# EAGLE design ESP32V1 based led+button (EAGLE 9.6.2)
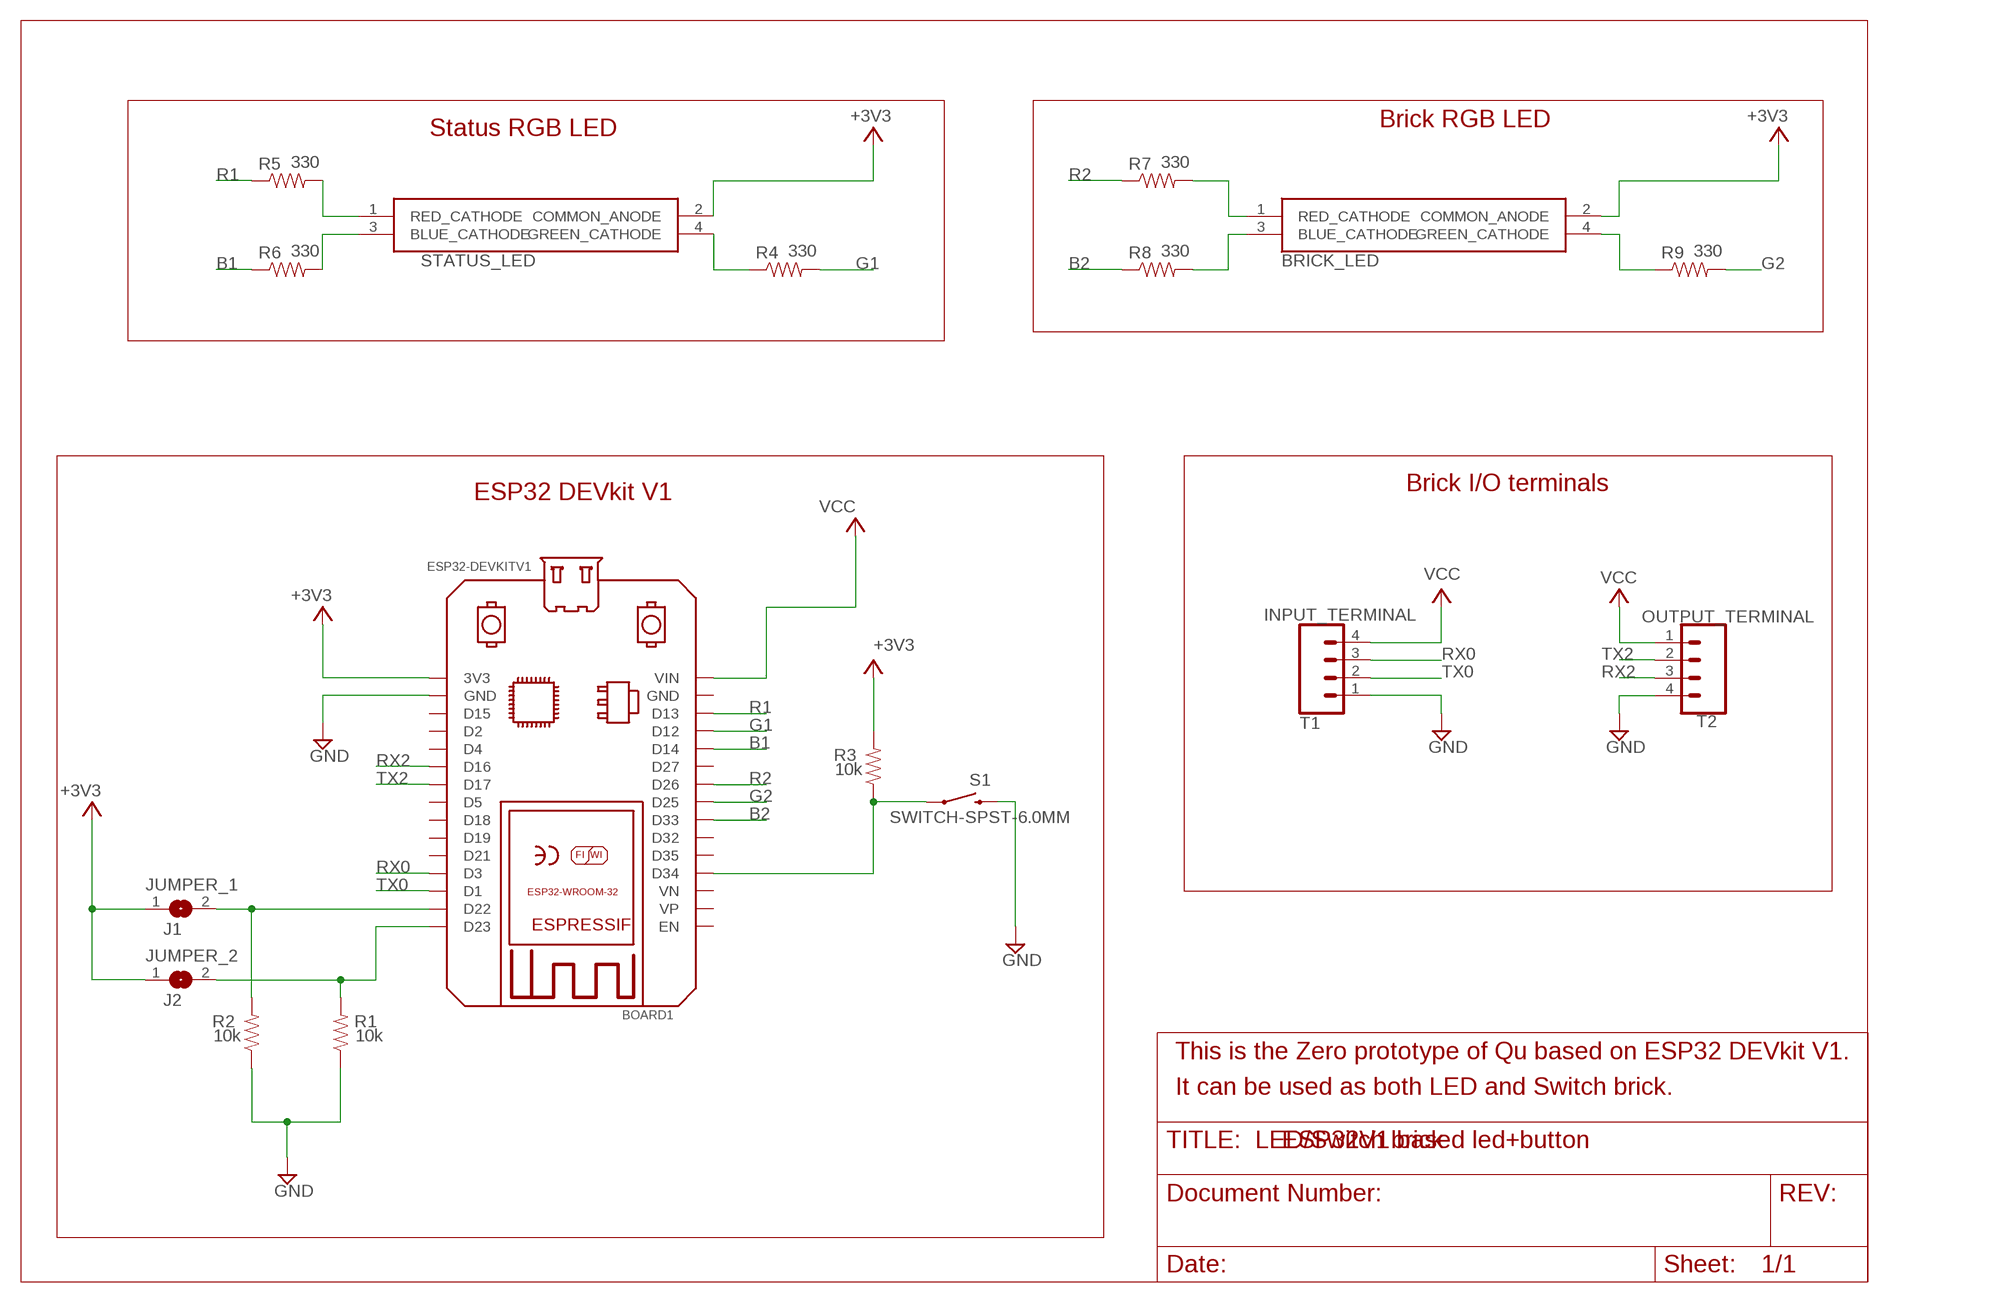
[diagram p0: schematic, sheet 1]

## Parts
BOARD1  ESP32DEVKITV1  [ESP32-DEVKITV1]
BRICK_LED  WP154A4SEJ3VBDZGW_CA  [L-154A4SUREQBFZGEC]
INPUT_TERMINAL  T1  CONN_04  [1X04]
JUMPER_1  J1  SJW  [SJW]
JUMPER_2  J2  SJW  [SJW]
OUTPUT_TERMINAL  T2  CONN_04  [1X04]
R1  10k  10KOHM-HORIZ-1/4W-1%  [AXIAL-0.3]
R2  10k  10KOHM-HORIZ-1/4W-1%  [AXIAL-0.3]
R3  10k  10KOHM-HORIZ-1/4W-1%  [AXIAL-0.3]
R4  330  330OHM-HORIZ-1/10W-5%  [AXIAL-0.3]
R5  330  330OHM-HORIZ-1/10W-5%  [AXIAL-0.3]
R6  330  330OHM-HORIZ-1/10W-5%  [AXIAL-0.3]
R7  330  330OHM-HORIZ-1/10W-5%  [AXIAL-0.3]
R8  330  330OHM-HORIZ-1/10W-5%  [AXIAL-0.3]
R9  330  330OHM-HORIZ-1/10W-5%  [AXIAL-0.3]
S1  SWITCH-SPST-6.0MM  MOMENTARY-SWITCH-SPST-PTH-6.0MM-KIT  [TACTILE_SWITCH_PTH_6.0MM_KIT]
STATUS_LED  WP154A4SEJ3VBDZGW_CA  [L-154A4SUREQBFZGEC]

## Nets
+3V3: BOARD1.3V3 BRICK_LED.2(COMMON_ANODE) JUMPER_1.1 JUMPER_2.1 R3.P$2 STATUS_LED.2(COMMON_ANODE)
B1: BOARD1.D14 R6.P$1
B2: BOARD1.D33 R8.P$1
G1: BOARD1.D12 R4.P$2
G2: BOARD1.D25 R9.P$2
GND: BOARD1.GND@1(GND) INPUT_TERMINAL.1 OUTPUT_TERMINAL.4 R1.P$1 R2.P$1 S1.3
N$1: BOARD1.D22 JUMPER_1.2 R2.P$2
N$3: BOARD1.D23 JUMPER_2.2 R1.P$2
N$6: R6.P$2 STATUS_LED.3(BLUE_CATHODE)
N$7: R5.P$2 STATUS_LED.1(RED_CATHODE)
N$9: BOARD1.D34 R3.P$1 S1.1
N$11: R4.P$1 STATUS_LED.4(GREEN_CATHODE)
N$14: BRICK_LED.3(BLUE_CATHODE) R8.P$2
N$15: BRICK_LED.1(RED_CATHODE) R7.P$2
N$16: BRICK_LED.4(GREEN_CATHODE) R9.P$1
R1: BOARD1.D13 R5.P$1
R2: BOARD1.D26 R7.P$1
RX0: BOARD1.D3 INPUT_TERMINAL.3
RX2: BOARD1.D16 OUTPUT_TERMINAL.3
TX0: BOARD1.D1 INPUT_TERMINAL.2
TX2: BOARD1.D17 OUTPUT_TERMINAL.2
VCC: BOARD1.VIN INPUT_TERMINAL.4 OUTPUT_TERMINAL.1
Unconnected: BOARD1.D2 BOARD1.D4 BOARD1.D5 BOARD1.D15 BOARD1.D18 BOARD1.D19 BOARD1.D21 BOARD1.D27 BOARD1.D32 BOARD1.D35 BOARD1.EN BOARD1.GND BOARD1.VN BOARD1.VP

## Notes on the sheet
- Brick RGB LED
- Status RGB LED
- Brick I/O terminals
- ESP32 DEVkit V1
- This is the Zero prototype of Qu based on ESP32 DEVkit V1.
- It can be used as both LED and Switch brick.
- LED/Switch brick

## Library data of the parts
BOARD1 = ESP32-DEVKITV1:ESP32DEVKITV1: https://github.com/shridattdudhat
BRICK_LED STATUS_LED = LED RGB:WP154A4SEJ3VBDZGW_CA: Standard LEDs - Through Hole 5MM RGB LED Source: Datasheet <http://www.kingbrightusa.com/images/catalog/SPEC/WP154A4SEJ3VBDZGW-CA.pdf>; DESCRIPTION: Standard LEDs - Through Hole 5MM RGB LED; HEIGHT: mm; MANUFACTURER_NAME: Kingbright; MANUFACTURER_PART_NUMBER: WP154A4SEJ3VBDZGW/CA; MOUSER_PART_NUMBER: 604-WP154A43VBDZGWCA; MOUSER_PRICE-STOCK: https://www.mouser.co.uk/ProductDetail/Kingbright/WP154A4SEJ3VBDZGW-CA?qs=YCa%2FAAYMW01xRqZww6UuiQ%3D%3D
INPUT_TERMINAL OUTPUT_TERMINAL = SparkFun-Connectors:CONN_04: Multi connection point. Often used as Generic Header-pin footprint for 0.1 inch spaced/style header connections On any of the 0.1 inch spaced packages, you can populate with these: Break Away Headers - Straight <https://www.sparkfun.com/products/116> (PRT-00116) Break Away Male Headers - Right Angle <https://www.sparkfun.com/products/553> (PRT-00553) Female Headers <https://www.sparkfun.com/products/115> (PRT-00115) Break Away Headers - Machine Pin <https://www.sparkfun.com/products/117> (PRT-00117) Break Away Female Headers - Swiss Machine Pin <https://www.sparkfun.com/products/743> (PRT-00743) For SCREWTERMINALS and SPRING TERMINALS visit here: Screw Terimnals on SparkFun.com <https://www.sparkfun.com/search/results?term=Screw+Terminals> (5mm/3.5mm/2.54mm spacing) This device is also useful as a general connection point to wire up your design to another part of your project. Our various solder wires solder well into these plated through hole pads. Hook-Up Wire - Assortment (Stranded, 22 AWG) <https://www.sparkfun.com/products/11375> (PRT-11375) Hook-Up Wire - Assortment (Solid Core, 22 AWG) <https://www.sparkfun.com/products/11367> (PRT-11367) View the entire wire category on our website here <https://www.sparkfun.com/categories/141> Special notes: Molex polarized connector foot print use with SKU : PRT-08231 with associated crimp pins and housings. 1MM SMD Version SKU: PRT-10208; PROD_ID: CONN-09696
JUMPER_1 JUMPER_2 = jumper:SJ: SMD solder JUMPER
R1-R3 = SparkFun-Resistors:10KOHM: 10kΩ resistor A resistor is a passive two-terminal electrical component that implements electrical resistance as a circuit element. Resistors act to reduce current flow, and, at the same time, act to lower voltage levels within circuits. - Wikipedia; PROD_ID: RES-12183
R4-R9 = SparkFun-Resistors:330OHM: 330Ω resistor A resistor is a passive two-terminal electrical component that implements electrical resistance as a circuit element. Resistors act to reduce current flow, and, at the same time, act to lower voltage levels within circuits. - Wikipedia; PROD_ID: RES-8371
S1 = SparkFun-Switches:MOMENTARY-SWITCH-SPST: Momentary Switch (Pushbutton) - SPST Normally-open (NO) SPST momentary switches (buttons, pushbuttons). Variants PTH-12MM - 12mm square, through-hole Momentary Pushbutton Switch - 12mm Square <https://www.sparkfun.com/products/9190> (COM-09190) PTH-6.0MM, PTH-6.0MM-KIT - 6.0mm square, through-hole Mini Pushbutton Switch <https://www.sparkfun.com/products/97> (COM-00097) KIT package intended for soldering kit's - only one side of pads' copper is exposed. PTH-RIGHT-ANGLE-KIT - Right-angle, through-hole Right Angle Tactile Button <https://www.sparkfun.com/products/10791> - Used on SparkFun BigTime Watch Kit <https://www.sparkfun.com/products/11734> SMD-12MM - 12mm square, surface-mount Tactile Button - SMD (12mm) <https://www.sparkfun.com/products/12993> (COM-12993) Used on SparkFun PicoBoard <https://www.sparkfun.com/products/11888> SMD-4.5MM - 4.5mm Square Trackball Switch Used on SparkFun Blackberry Trackballer Breakout <https://www.sparkfun.com/products/13169> SMD-4.6MMX2.8MM - 4.60mm x 2.80mm, surface mount Used on SparkFun SAMD21 Mini Breakout <https://www.sparkfun.com/products/13664> SMD-5.2MM, SMD-5.2-REDUNDANT - 5.2mm square, surface-mount Mini Pushbutton Switch - SMD <https://www.sparkfun.com/products/8720> (COM-08720) Used on Arduino Pro Mini <https://www.sparkfun.com/products/11114> REDUNDANT package connects both switch circuits together SMD-6.0X3.5MM - 6.0 x 3.5mm, surface mount Momentary Reset Switch SMD <https://www.sparkfun.com/products/8229> (COM-08229) SMD-6.2MM-TALL - 6.2mm square, surface mount Tactile Button - SMD (6mm) <https://www.sparkfun.com/products/12992> Used on SparkFun Digital Sandbox <https://www.sparkfun.com/products/12651> SMD-RIGHT-ANGLE - Right-angle, surface mount Used on SparkFun Block for Intel® Edison - Arduino <https://www.sparkfun.com/products/13036>; PROD_ID: SWCH-08441; SF_SKU: COM-00097

## Board
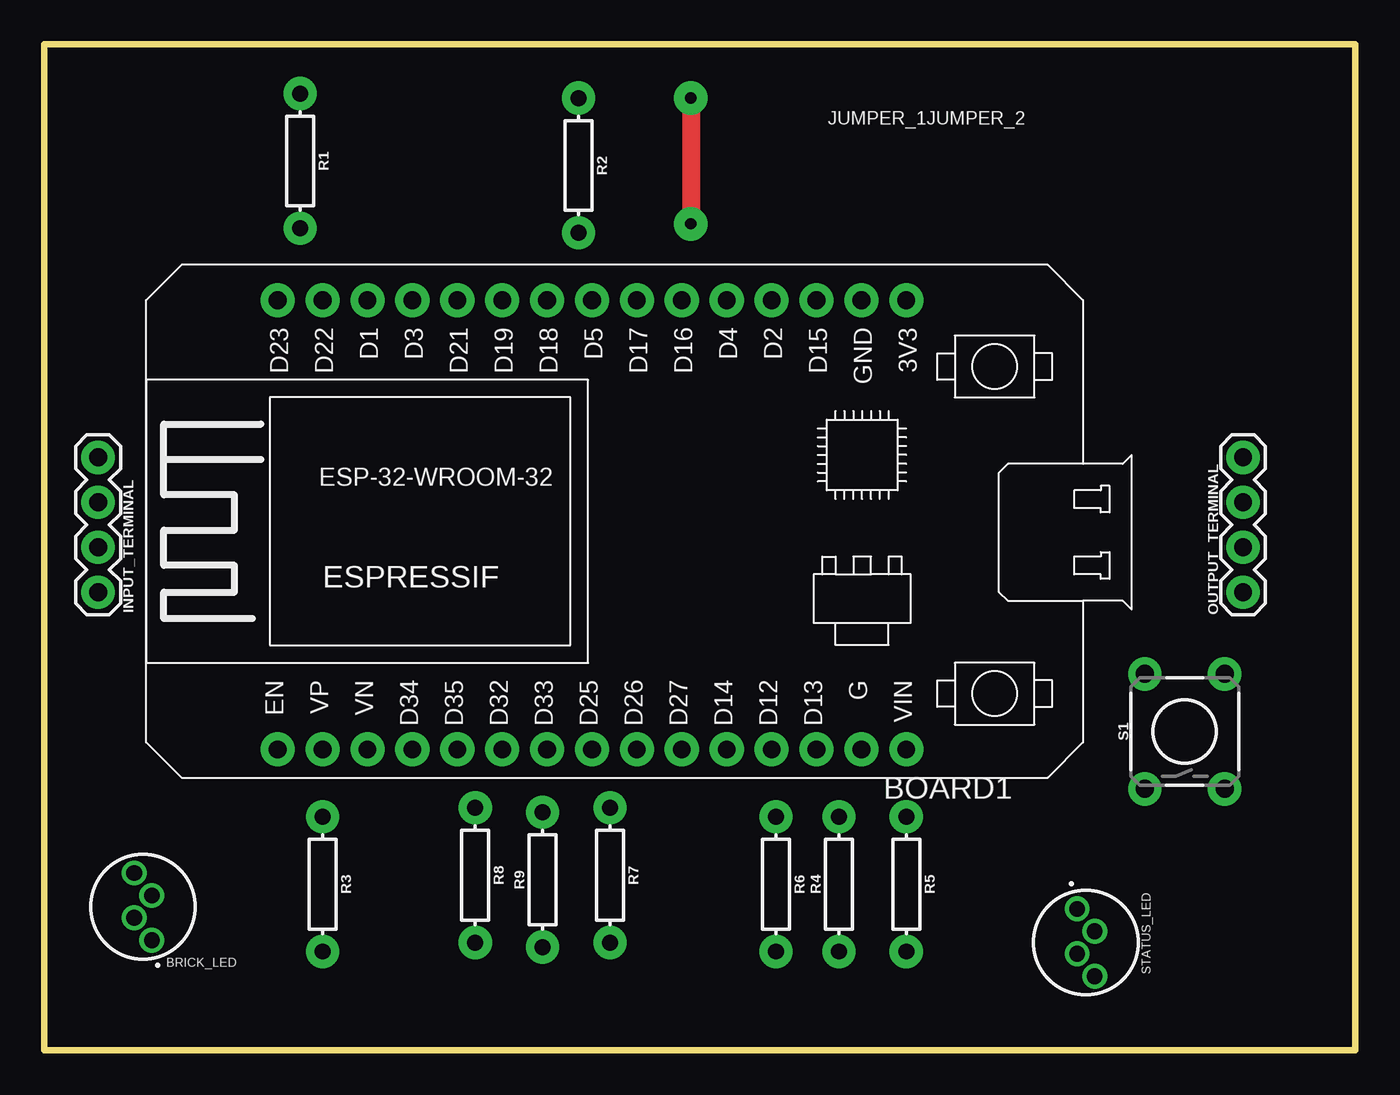
[diagram p1: board, top side]
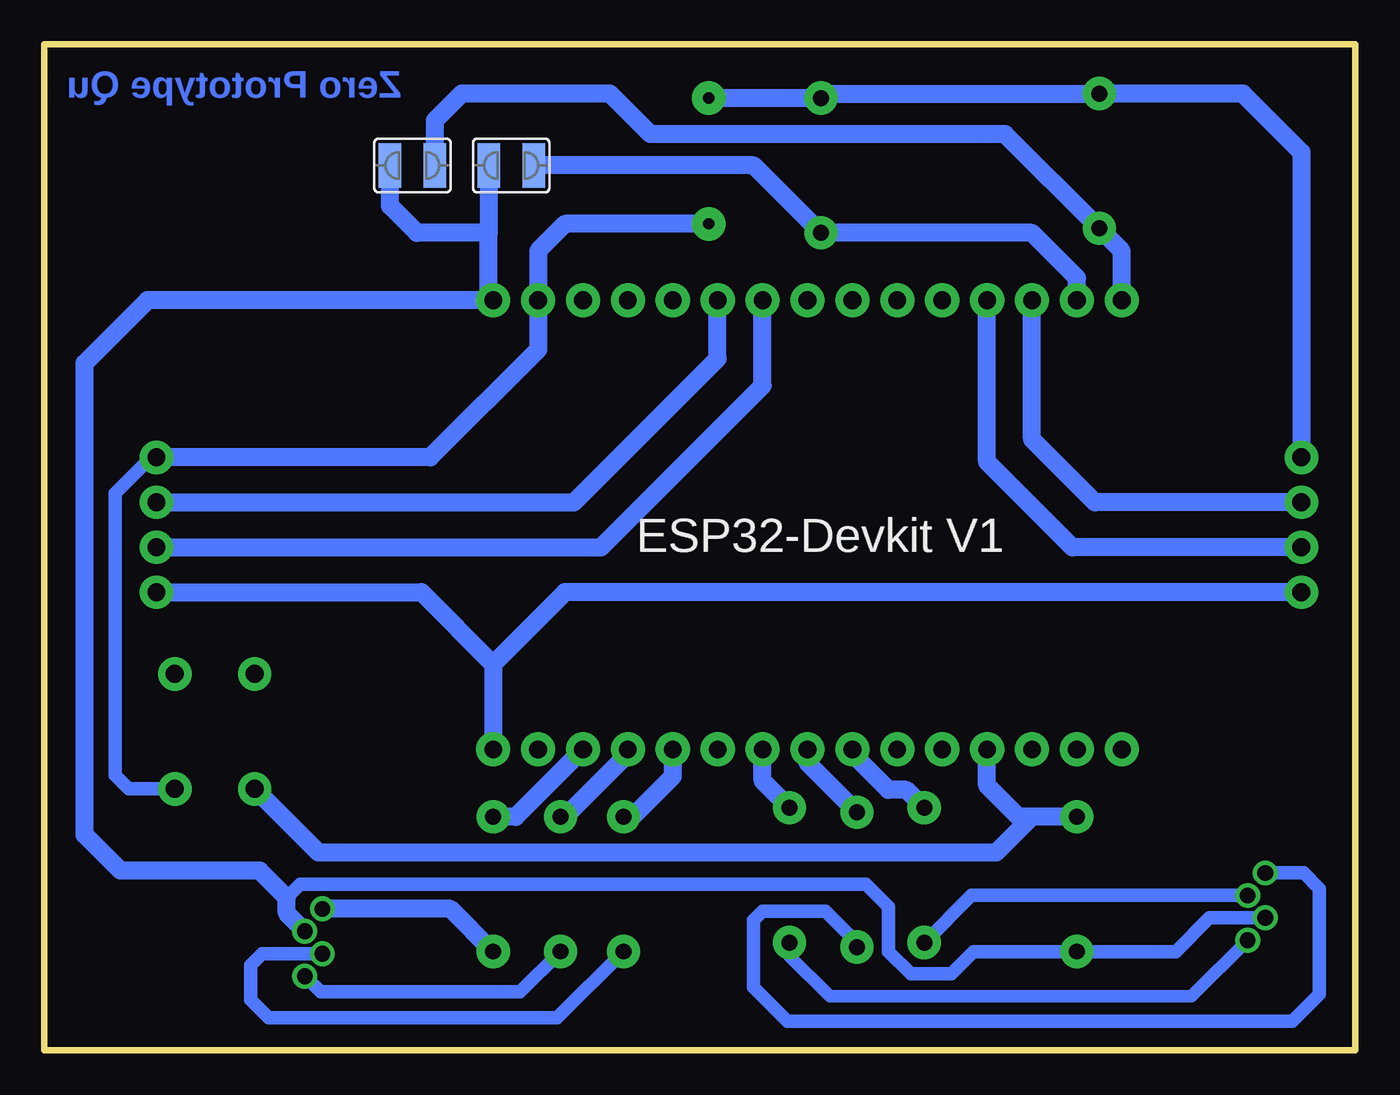
[diagram p2: board, bottom side, seen from below]

Size 74.17 x 56.9 mm. Coordinates in mm from the lower left corner, seen from the top.
Outline: 0,56.9 0,0 74.17,0 74.17,56.9 0,56.9
Copper layers (1*16): Top 0.035mm / dielectric 1.5mm / Bottom 0.035mm
Design rules "default *": minimum track width 10mil, minimum drill 0.35mm, track to track 6mil, track to pad 6mil, pad to pad 6mil, via to via 6mil, smd to smd 6mil, copper to edge 40mil, drill to drill 6mil, minimum pad ring 10mil, minimum via ring 8mil, stop-mask expansion 4mil, vias tented up to drill 0mil, thermal gap 10mil

### Footprints (pad centres in the part's own frame; a part is rotated, then mirrored left to right if it is on the bottom)
ESP32-DEVKITV1 = drill 1 pad 1.93: 3V3 0,0; D1 30.48,0; D2 7.62,0; D3 27.94,0; D4 10.16,0; D5 17.78,0; D12 7.62,25.4; D13 5.08,25.4; D14 10.16,25.4; D15 5.08,0; D16 12.7,0; D17 15.24,0; D18 20.32,0; D19 22.86,0; D21 25.4,0; D22 33.02,0; D23 35.56,0; D25 17.78,25.4; D26 15.24,25.4; D27 12.7,25.4; D32 22.86,25.4; D33 20.32,25.4; D34 27.94,25.4; D35 25.4,25.4; EN 35.56,25.4; GND 2.54,25.4; GND@1 2.54,0; VIN 0,25.4; VN 30.48,25.4; VP 33.02,25.4
L-154A4SUREQBFZGEC = drill 0.889 pad 1.4: 1 0.5,-1.905; 2 -0.5,-0.635; 3 0.5,0.635; 4 -0.5,1.905
1X04 = drill 1.016 pad 1.88: 1 0,0; 2 2.54,0; 3 5.08,0; 4 7.62,0
SJW = smd 1.27 x 2.54: 1 -1.27,0; 2 1.27,0
AXIAL-0.3 = drill 0.9 pad 1.88: P$1 -3.81,0; P$2 3.81,0
TACTILE_SWITCH_PTH_6.0MM_KIT = drill 1.016 pad 1.88: 1 -3.251,2.261; 2 3.251,2.261; 3 -3.251,-2.261; 4 3.251,-2.261

### Placement (x,y rotation side)
BOARD1  48.77,42.42 180 top
BRICK_LED  5.59,8.13 0 top
INPUT_TERMINAL  3.05,33.53 270 top
JUMPER_1  47.75,50.04 0 bottom
JUMPER_2  53.34,50.04 0 bottom
OUTPUT_TERMINAL  67.82,25.91 90 top
R1  14.48,50.29 270 top
R2  30.23,50.04 270 top
R3  15.75,9.4 270 top
R4  44.96,9.4 90 top
R5  48.77,9.4 270 top
R6  41.4,9.4 270 top
R7  32,9.91 270 top
R8  24.38,9.91 270 top
R9  28.19,9.65 90 top
S1  64.52,18.03 90 top
STATUS_LED  58.93,6.1 180 top

### Tracks (layer width: path | path; a pad name or v marks a point on that pad's centre or on a via)
+3V3
  Bottom 0.508: 60.71,8.38 60.45,8.64
  Bottom 0.762: BRICK_LED.2 8.26,7.49 10.16,5.59 R3.P$2 21.59,5.59 22.86,4.32 25.15,4.32 26.42,5.59 26.42,8.13 27.69,9.4 59.69,9.4 60.45,8.64
  Bottom 1.016: JUMPER_1.1 49.02,46.23 | 49.02,46.23 53.09,46.23 54.61,47.75 JUMPER_2.1 | STATUS_LED.2 60.45,7.75 60.45,8.64 61.98,10.16 69.85,10.16 71.88,12.19 71.88,38.86 68.33,42.42 BOARD1.3V3 49.02,42.67 49.02,46.23
B1
  Bottom 1.016: R6.P$1 40.89,13.21 38.61,15.49 BOARD1.D14
B2
  Bottom 1.016: R8.P$1 25.4,14.73 26.42,14.73 28.45,16.76 BOARD1.D33
G1
  Bottom 1.016: R4.P$2 44.7,13.21 41.15,16.76 BOARD1.D12
G2
  Bottom 1.016: R9.P$2 30.99,16.26 BOARD1.D25
GND  (via drill 0.64 pad 1.91)
  Top 1.016: v36.58,53.85 v36.58,46.74
  Bottom 0.254: 3.2,33.63 INPUT_TERMINAL.1 | 68.12,33.53 OUTPUT_TERMINAL.4 67.82,33.63
  Bottom 0.762: S1.3 69.39,14.78 70.16,15.55 70.16,31.5 68.12,33.53
  Bottom 1.016: 68.12,33.53 52.32,33.53 46.23,39.62 BOARD1.GND@1 46.23,45.21 44.7,46.74 v36.58,46.74 | INPUT_TERMINAL.1 3.05,50.8 6.35,54.1 R1.P$1 29.97,54.1 R2.P$1 v36.58,53.85
N$1
  Bottom 1.016: BOARD1.D22 15.75,43.69 18.29,46.23 R2.P$2 34.04,50.04 JUMPER_1.2
N$3
  Bottom 0.254: 52.07,50.6 52.07,50.29 JUMPER_2.2
  Bottom 1.016: BOARD1.D23 13.21,45.21 R1.P$2 19.81,51.82 39.88,51.82 42.16,54.1 50.55,54.1 52.07,52.58 52.07,50.29
N$6
  Bottom 0.762: R6.P$2 45.15,1.84 61.47,1.84 62.48,2.86 62.48,4.83 61.85,5.46 STATUS_LED.3
N$7
  Bottom 1.016: R5.P$2 51.18,8 STATUS_LED.1
N$9
  Bottom 1.016: R3.P$1 18.29,13.21 | 18.29,13.21 19.05,13.21 20.83,14.99 BOARD1.D34 | 18.29,13.21 20.32,11.18 58.65,11.18 S1.1
N$11
  Bottom 0.762: R4.P$1 47.24,3.3 58.54,3.3 STATUS_LED.4
N$14
  Bottom 0.762: BRICK_LED.3 21.72,8.76 R8.P$2
N$15
  Bottom 0.711: BRICK_LED.1 9.26,3.05 29.72,3.05 32,5.33 R7.P$2
N$16
  Bottom 0.762: BRICK_LED.4 2.92,10.03 2.03,9.14 2.03,3.17 3.56,1.65 32.13,1.65 34.04,3.56 34.04,7.37 33.53,7.87 29.97,7.87 28.19,6.1 R9.P$1
R1
  Bottom 1.016: BOARD1.D13 47.5,13.21 R5.P$1
R2
  Bottom 1.016: R7.P$1 33.53,15.24 BOARD1.D26
RX0
  Bottom 0.254: 3.2,28.55 INPUT_TERMINAL.3
  Bottom 1.016: INPUT_TERMINAL.3 16,28.45 20.83,33.27 BOARD1.D3
RX2
  Bottom 1.016: BOARD1.D16 36.07,39.12 44.2,30.99 OUTPUT_TERMINAL.3
TX0
  Bottom 1.016: INPUT_TERMINAL.2 14.73,30.99 18.29,34.54 BOARD1.D1
TX2
  Bottom 0.254: 67.82,28.55 OUTPUT_TERMINAL.2
  Bottom 1.016: OUTPUT_TERMINAL.2 42.67,28.45 33.53,37.59 BOARD1.D17
VCC
  Bottom 0.254: 48.72,17.17 BOARD1.VIN
  Bottom 1.016: INPUT_TERMINAL.4 44.7,25.91 48.77,21.84 | 48.77,21.84 BOARD1.VIN | 48.77,21.84 52.83,25.91 OUTPUT_TERMINAL.1

### Text on the board
Bottom: Zero Prototype Qu